# EAGLE schematic main (EAGLE 6.5.0)
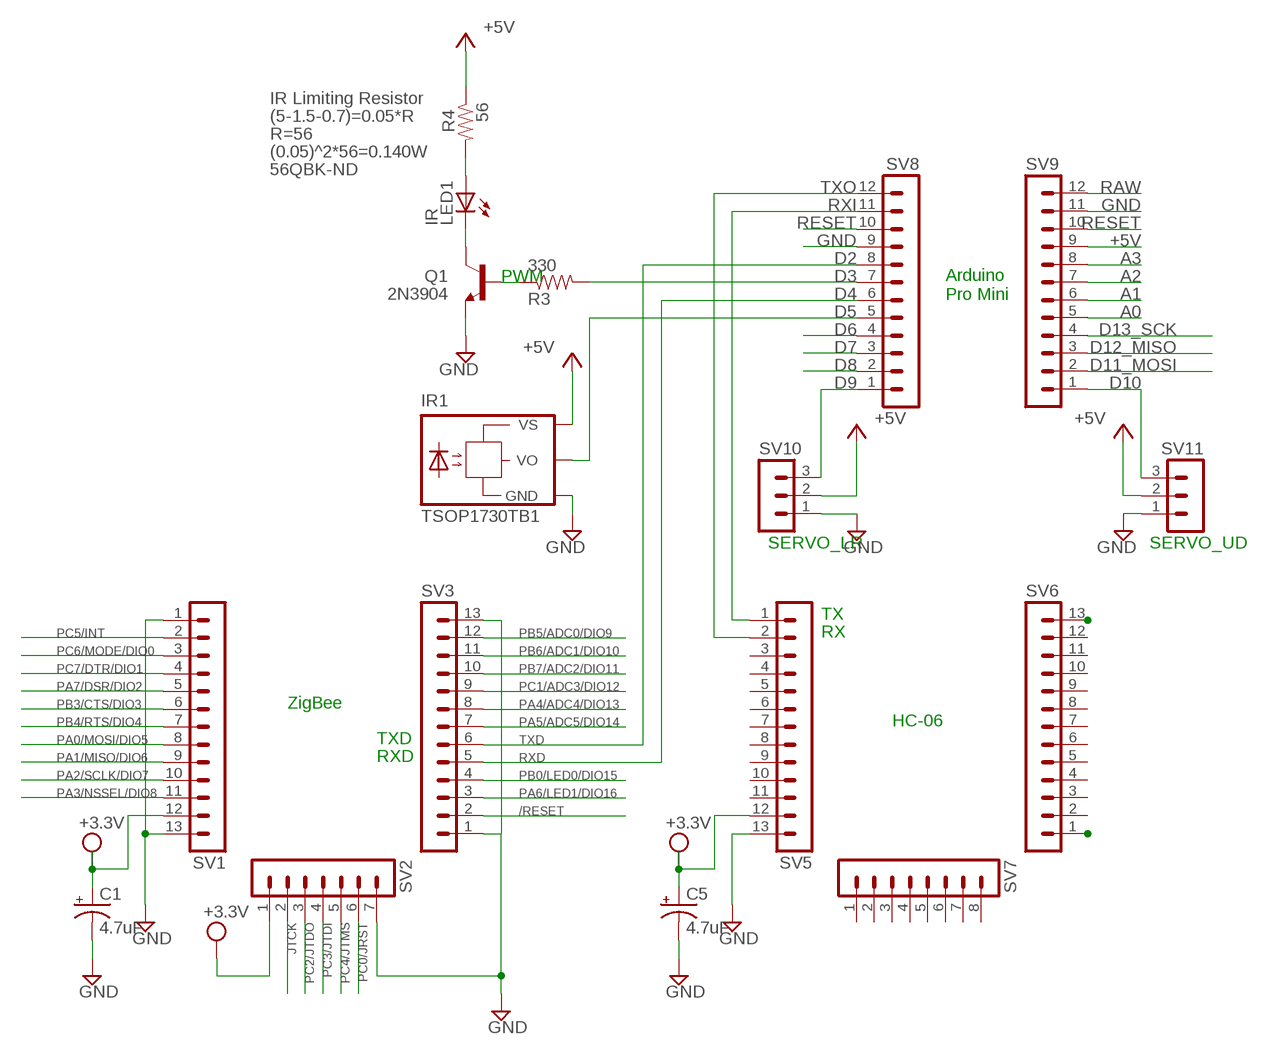
[diagram p0: schematic, sheet 1]

## Parts
C1  4.7uF  CPOL-USSANYO_SMD_A5  [SANYO-OSCON_SMD_A5]
C5  4.7uF  CPOL-USSANYO_SMD_A5  [SANYO-OSCON_SMD_A5]
IR1  TSOP1730TB1  [TSOP17_TB1]
LED1  IR  LED5MM  [LED5MM]
Q1  2N3904  TRANSISTOR_NPNTO92  [TO-92]
R3  330  RESISTORAXIAL-0.3  [AXIAL-0.3]
R4  56  RESISTORAXIAL-0.3  [AXIAL-0.3]
SV1  MA13-1  [MA13-1]
SV2  MA07-1  [MA07-1]
SV3  MA13-1  [MA13-1]
SV5  MA13-1  [MA13-1]
SV6  MA13-1  [MA13-1]
SV7  MA08-1  [MA08-1]
SV8  MA12-1  [MA12-1]
SV9  MA12-1  [MA12-1]
SV10  MA03-1  [MA03-1]
SV11  MA03-1  [MA03-1]

## Nets
+5V: IR1.VS R4.P$1 SV9.9 SV10.2 SV11.2
/RESET: SV3.2
A0: SV9.5
A1: SV9.6
A2: SV9.7
A3: SV9.8
D2: SV8.8
D3: R3.P$2 SV8.7
D4: SV8.6
D5: IR1.VO SV8.5
D6: SV8.4
D7: SV8.3
D8: SV8.2
D9: SV8.1 SV10.3
D10: SV9.1 SV11.3
D11_MOSI: SV9.2
D12_MISO: SV9.3
D13_SCK: SV9.4
GND: C1.- C5.- IR1.GND Q1.1(E) SV1.1 SV1.13 SV2.7 SV3.1 SV3.13 SV5.13 SV8.9 SV9.11 SV10.1 SV11.1
GND1: SV6.1 SV6.13
JTCK: SV2.2
N$5: Q1.2(B) R3.P$1
N$6: LED1.A R4.P$2
N$7: LED1.K(C) Q1.3(C)
PA0/MOSI/DIO5: SV1.8
PA1/MISO/DIO6: SV1.9
PA2/SCLK/DIO7: SV1.10
PA3/NSSEL/DIO8: SV1.11
PA4/ADC4/DIO13: SV3.8
PA5/ADC5/DIO14: SV3.7
PA6/LED1/DIO16: SV3.3
PA7/DSR/DIO2: SV1.5
PB0/LED0/DIO15: SV3.4
PB3/CTS/DIO3: SV1.6
PB4/RTS/DIO4: SV1.7
PB5/ADC0/DIO9: SV3.12
PB6/ADC1/DIO10: SV3.11
PB7/ADC2/DIO11: SV3.10
PC0/JRST: SV2.6
PC1/ADC3/DIO12: SV3.9
PC2/JTDO: SV2.3
PC3/JTDI: SV2.4
PC4/JTMS: SV2.5
PC5/INT: SV1.2
PC6/MODE/DIO0: SV1.3
PC7/DTR/DIO1: SV1.4
RAW: SV9.12
RESET: SV8.10 SV9.10
RXD: SV3.5
RXI: SV5.1 SV8.11
TXD: SV3.6
TXO: SV5.2 SV8.12
VCC: C1.+ C5.+ SV1.12 SV2.1 SV5.12 ; supply symbol labelled +3.3V
Unconnected: SV5.3 SV5.4 SV5.5 SV5.6 SV5.7 SV5.8 SV5.9 SV5.10 SV5.11 SV6.2 SV6.3 SV6.4 SV6.5 SV6.6 SV6.7 SV6.8 SV6.9 SV6.10 SV6.11 SV6.12 SV7.1 SV7.2 SV7.3 SV7.4 SV7.5 SV7.6 SV7.7 SV7.8

## Notes on the sheet
- IR Limiting Resistor
- (5-1.5-0.7)=0.05*R
- R=56
- (0.05)^2*56=0.140W
- 56QBK-ND
- PWM
- Arduino
  Pro Mini
- SERVO_LR | SERVO_UD
- TX
- RX
- ZigBee
- HC-06
- TXD
- RXD

## Library data of the parts
C1 C5 = rcl:CPOL-US: POLARIZED CAPACITOR, American symbol
IR1 = telefunken:TSOP17*TB1: TSOP17..TB1 IR Receiver Modules for Remote Control Systems Source: http://www.vishay.com/docs/82042/82042.pdf; OC_FARNELL: unknown; OC_NEWARK: unknown
LED1 = SparkFun:LED: LEDs Standard schematic elements and footprints for 5mm, 3mm, 1206, and 0603 sized LEDs. 5mm - Spark Fun Electronics SKU : COM-00529 (and others)
Q1 = SparkFun:TRANSISTOR_NPN: Transistor NPN BJT configuration in SOT23 package. MMBT2222 is the common NPN we use. Double check BCE configuration again layout.
R3 R4 = SparkFun:RESISTOR: Resistor Basic schematic elements and footprints for 0603, 1206, and PTH resistors.
SV1 SV3 SV5 SV6 = con-lstb:MA13-1: PIN HEADER; OC_FARNELL: unknown; OC_NEWARK: unknown
SV2 = con-lstb:MA07-1: PIN HEADER; OC_FARNELL: unknown; OC_NEWARK: unknown
SV7 = con-lstb:MA08-1: PIN HEADER; OC_FARNELL: unknown; OC_NEWARK: unknown
SV8 SV9 = con-lstb:MA12-1: PIN HEADER; OC_FARNELL: unknown; OC_NEWARK: unknown
SV10 SV11 = con-lstb:MA03-1: PIN HEADER; OC_FARNELL: unknown; OC_NEWARK: unknown

## Net classes
1 vcc: width 0.254 mm